# EAGLE schematic SchematicEagle (EAGLE 6.6.0)
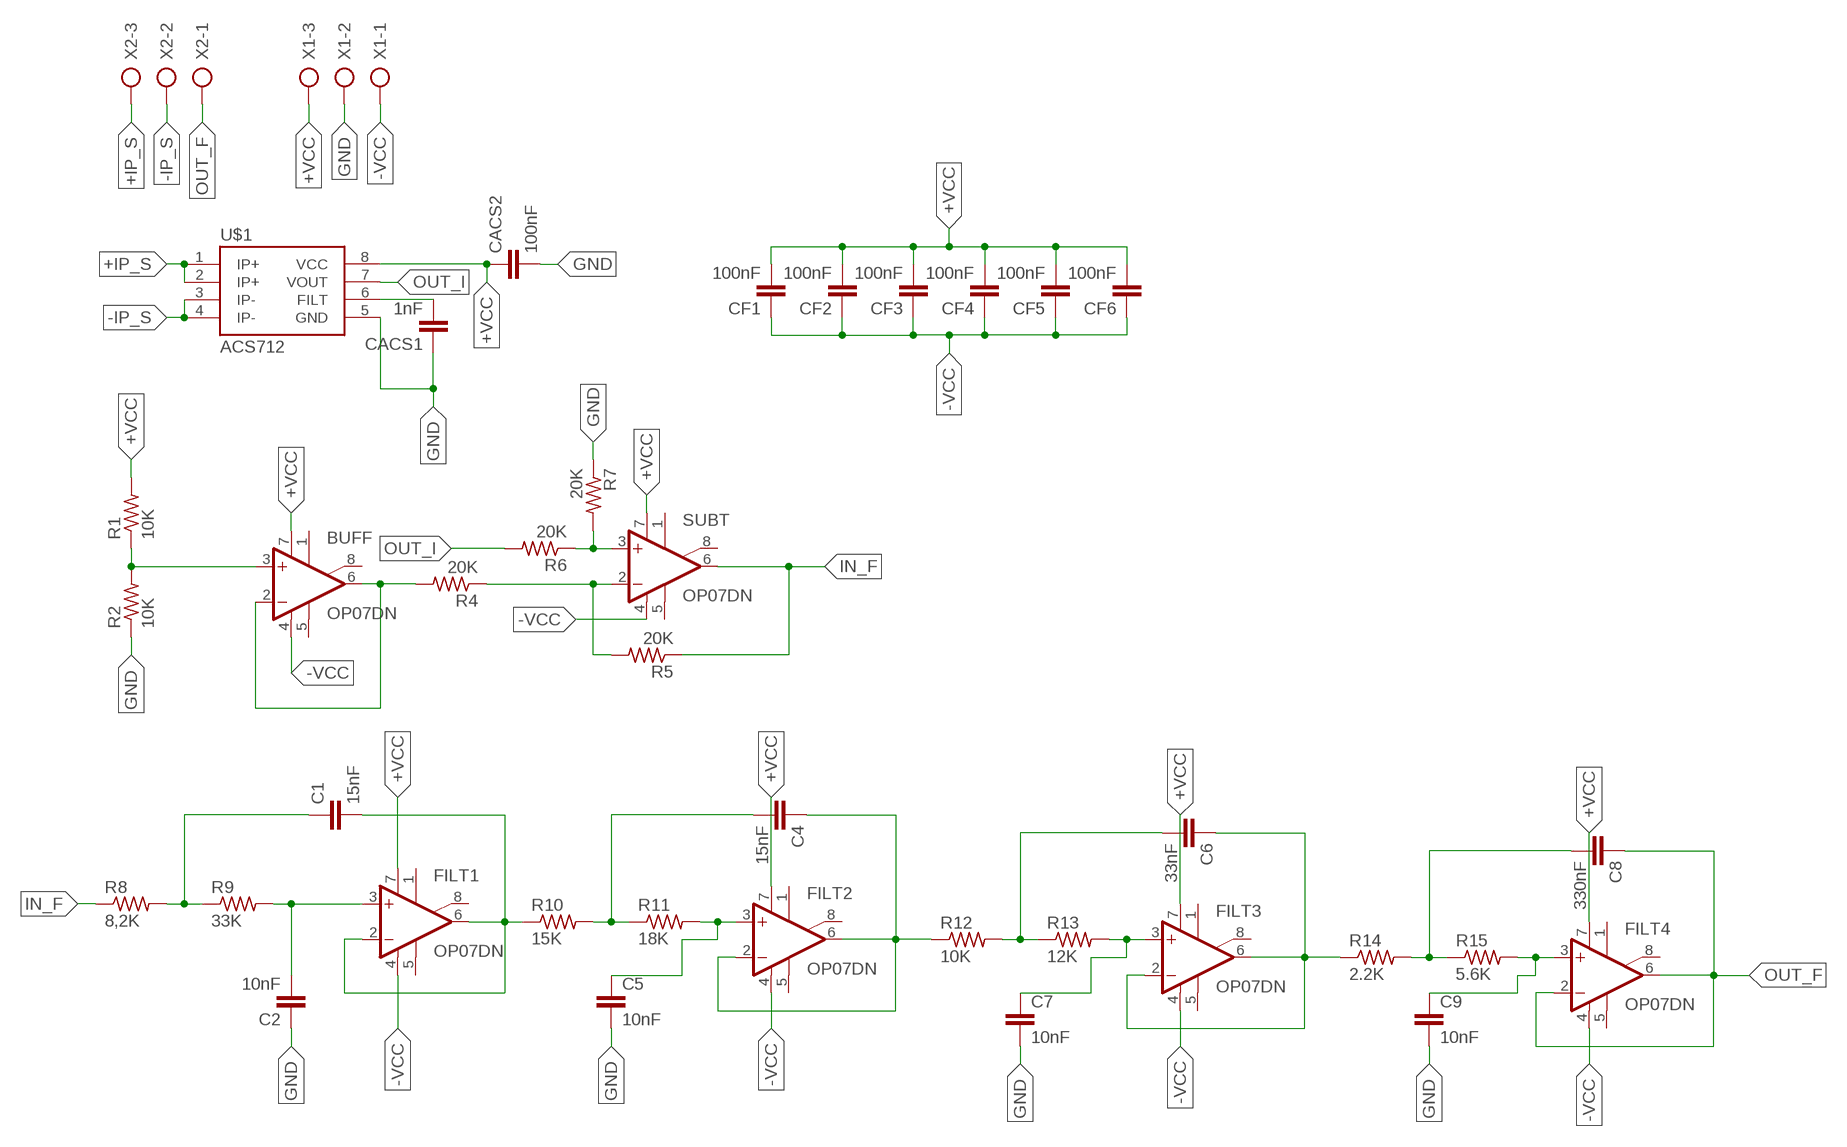
[diagram p0: schematic, sheet 1]

## Parts
BUFF  OP07DN  [DIL08]
C1  15nF  C-EU050-024X044  [C050-024X044]
C2  10nF  C-EU050-024X044  [C050-024X044]
C4  15nF  C-EU050-024X044  [C050-024X044]
C5  10nF  C-EU050-024X044  [C050-024X044]
C6  33nF  C-EU050-024X044  [C050-024X044]
C7  10nF  C-EU050-024X044  [C050-024X044]
C8  330nF  C-EU050-024X044  [C050-024X044]
C9  10nF  C-EU050-024X044  [C050-024X044]
CACS1  1nF  C-EU050-024X044  [C050-024X044]
CACS2  100nF  C-EU050-024X044  [C050-024X044]
CF1  100nF  C-EU050-024X044  [C050-024X044]
CF2  100nF  C-EU050-024X044  [C050-024X044]
CF3  100nF  C-EU050-024X044  [C050-024X044]
CF4  100nF  C-EU050-024X044  [C050-024X044]
CF5  100nF  C-EU050-024X044  [C050-024X044]
CF6  100nF  C-EU050-024X044  [C050-024X044]
FILT1  OP07DN  [DIL08]
FILT2  OP07DN  [DIL08]
FILT3  OP07DN  [DIL08]
FILT4  OP07DN  [DIL08]
R1  10K  R-US_0207/7  [0207/7]
R2  10K  R-US_0207/7  [0207/7]
R4  20K  R-US_0207/7  [0207/7]
R5  20K  R-US_0207/7  [0207/7]
R6  20K  R-US_0207/7  [0207/7]
R7  20K  R-US_0207/7  [0207/7]
R8  8,2K  R-US_0207/7  [0207/7]
R9  33K  R-US_0207/7  [0207/7]
R10  15K  R-US_0207/7  [0207/7]
R11  18K  R-US_0207/7  [0207/7]
R12  10K  R-US_0207/7  [0207/7]
R13  12K  R-US_0207/7  [0207/7]
R14  2.2K  R-US_0207/7  [0207/7]
R15  5.6K  R-US_0207/7  [0207/7]
SUBT  OP07DN  [DIL08]
U$1  ACS712  [SO08]
X1  AK500/3  [AK500/3]
X2  AK500/3  [AK500/3]

## Nets
+IP_S: U$1.1(IP+) U$1.2(IP+) X2.3
+VCC: BUFF.7(V+) CACS2.1 CF1.2 CF2.2 CF3.2 CF4.2 CF5.2 CF6.2 FILT1.7(V+) FILT2.7(V+) FILT3.7(V+) FILT4.7(V+) R1.2 SUBT.7(V+) U$1.8(VCC) X1.3
-IP_S: U$1.3(IP-) U$1.4(IP-) X2.2
-VCC: BUFF.4(V-) CF1.1 CF2.1 CF3.1 CF4.1 CF5.1 CF6.1 FILT1.4(V-) FILT2.4(V-) FILT3.4(V-) FILT4.4(V-) SUBT.4(V-) X1.1
GND: C2.1 C5.2 C7.2 C9.2 CACS1.1 CACS2.2 R2.1 R7.1 U$1.5(GND) X1.2
IN_F: R5.1 R8.1 SUBT.6(OUT)
N$1: BUFF.3(+IN) R1.1 R2.2
N$2: C1.1 R8.2 R9.1
N$3: R4.1 R5.2 SUBT.2(-IN)
N$4: C2.2 FILT1.3(+IN) R9.2
N$5: R6.1 R7.2 SUBT.3(+IN)
N$6: C1.2 FILT1.2(-IN) FILT1.6(OUT) R10.1
N$7: BUFF.2(-IN) BUFF.6(OUT) R4.2
N$8: C4.2 R10.2 R11.1
N$9: C4.1 FILT2.2(-IN) FILT2.6(OUT) R12.1
N$10: C5.1 FILT2.3(+IN) R11.2
N$11: C6.2 R12.2 R13.1
N$12: C6.1 FILT3.2(-IN) FILT3.6(OUT) R14.1
N$13: C7.1 FILT3.3(+IN) R13.2
N$14: CACS1.2 U$1.6(FILT)
N$15: C8.2 R14.2 R15.1
N$17: C9.1 FILT4.3(+IN) R15.2
OUT_F: C8.1 FILT4.2(-IN) FILT4.6(OUT) X2.1
OUT_I: R6.2 U$1.7(VOUT)
Unconnected: BUFF.1(ON1) BUFF.5(OPT) BUFF.8(ON2) FILT1.1(ON1) FILT1.5(OPT) FILT1.8(ON2) FILT2.1(ON1) FILT2.5(OPT) FILT2.8(ON2) FILT3.1(ON1) FILT3.5(OPT) FILT3.8(ON2) FILT4.1(ON1) FILT4.5(OPT) FILT4.8(ON2) SUBT.1(ON1) SUBT.5(OPT) SUBT.8(ON2)

## Library data of the parts
BUFF FILT1-FILT4 SUBT = linear:OP07*: OP AMP
C1 C2 C4-C9 CACS1 CACS2 CF1-CF6 = rcl:C-EU: CAPACITOR, European symbol
R1 R2 R4-R15 = rcl:R-US_: RESISTOR, American symbol
U$1 = 1_SparkFun:ACS712
X1 X2 = con-ptr500:AK500/3: CONNECTOR; OC_FARNELL: unknown; OC_NEWARK: unknown